# Altium project nixie display ark.PrjPCB
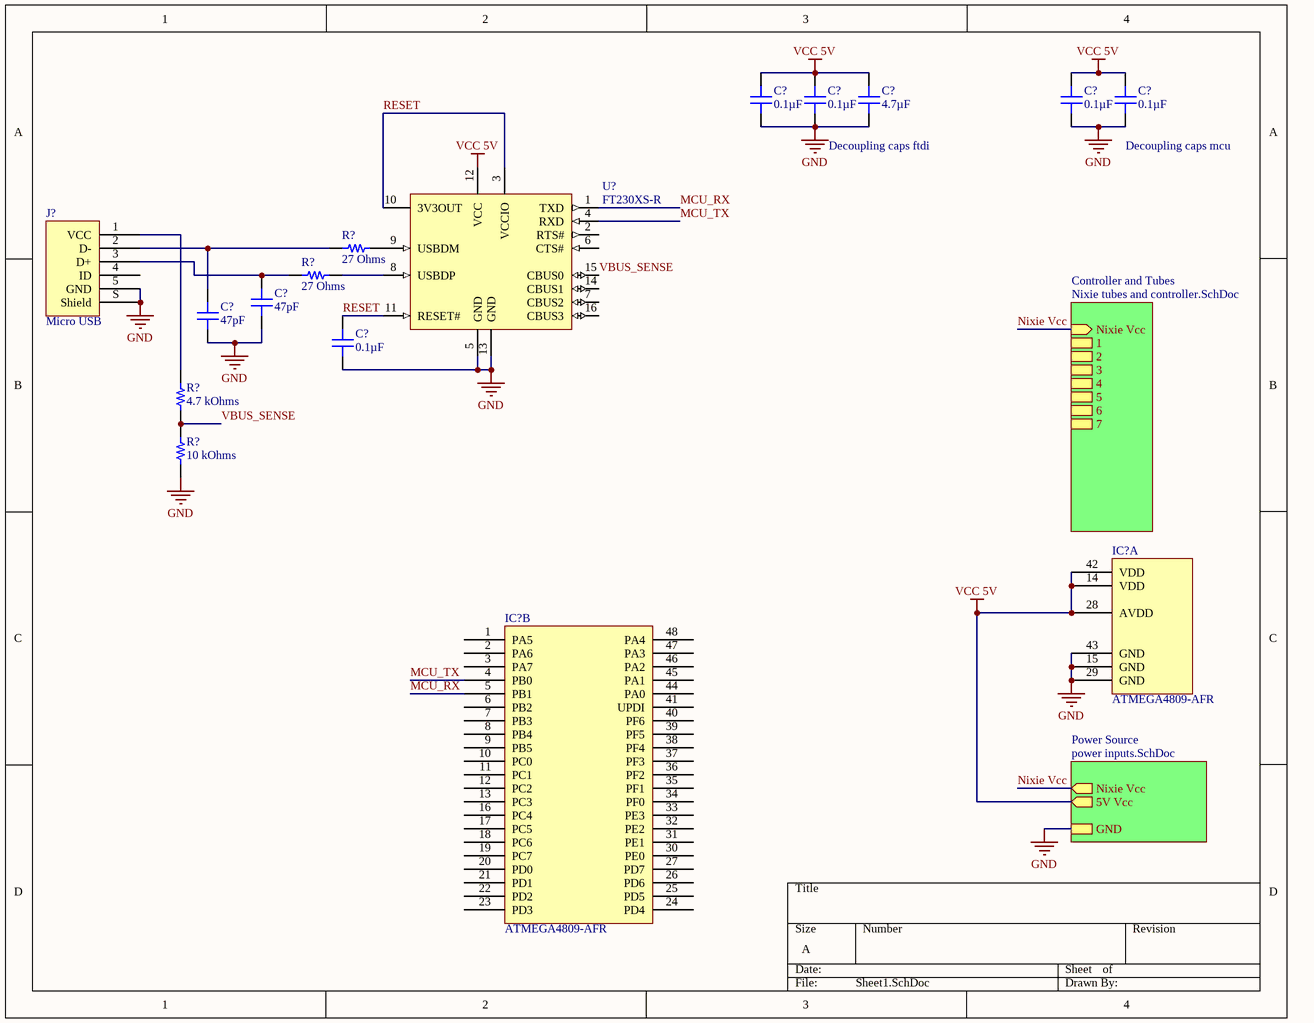
[diagram p0: Sheet1.SchDoc]
3 sheets, 35 parts. Net scope: hierarchical (ports join the sheet entries above them; power ports are global).
Sheets:
  Sheet1.SchDoc
    Controller and Tubes = Nixie tubes and controller.SchDoc
    Power Source = power inputs.SchDoc

## Sheet Sheet1.SchDoc
size A

### Parts
(Parts that share a designator on the sheet are numbered #1, #2 ... from top to bottom, then left to right.)
C?#1  0.1µF  [CAP 0805_2012]
C?#2  0.1µF  [CAP 0805_2012]
C?#3  4.7µF  [CAP 0805_2012]
C?#4  0.1µF  [CAP 0805_2012]
C?#5  0.1µF  [CAP 0805_2012]
C?#6  47pF  [CAP 0805_2012]
C?#7  47pF  [CAP 0805_2012]
C?#8  0.1µF  [CAP 0805_2012]
IC?#1  ATMEGA4809-AFR  [ATMEGA4809-AFR]  (part A of 2)
IC?#2  ATMEGA4809-AFR  [ATMEGA4809-AFR]  (part B of 2)
J?#1  Micro USB  [FCI USB 10118193-0001LF]
R?#1  27 Ohms  [RES 0805_2012]
R?#2  27 Ohms  [RES 0805_2012]
R?#3  4.7 kOhms  [RES 0805_2012]
R?#4  10 kOhms  [RES 0805_2012]
U?#1  FT230XS-R  [SSOP-16_M]

### Sub-sheets
Controller and Tubes = Nixie tubes and controller.SchDoc: Nixie Vcc (in), 1, 2, 3, 4, 5, 6, 7
Power Source = power inputs.SchDoc: 5V Vcc (out), Nixie Vcc (out), GND

### Nets
GND: C?#1.1 C?#2.1 C?#3.1 C?#4.1 C?#5.1 C?#6.1 C?#7.1 C?#8.1 IC?#1.15(GND) IC?#1.29(GND) IC?#1.43(GND) J?#1.5(GND) J?#1.S(Shield) R?#4.1 U?#1.5(GND) U?#1.13(GND) ; sheet Power Source/GND
Nixie Vcc: sheet Controller and Tubes/Nixie Vcc, sheet Power Source/Nixie Vcc
VCC 5V: C?#1.2 C?#2.2 C?#3.2 C?#4.2 C?#5.2 IC?#1.14(VDD) IC?#1.28(AVDD) IC?#1.42(VDD) U?#1.12(VCC) ; sheet Power Source/5V Vcc
MCU_RX: IC?#2.5(PB1) U?#1.1(TXD)
MCU_TX: IC?#2.4(PB0) U?#1.4(RXD)
RESET: C?#8.2 U?#1.3(VCCIO) U?#1.10(3V3OUT) U?#1.11(RESET#)
VBUS_SENSE: R?#3.1 R?#4.2 U?#1.15(CBUS0)
NetC?#6_2: C?#6.2 J?#1.3(D+) R?#2.1
NetC?#7_2: C?#7.2 J?#1.2(D-) R?#1.1
NetJ?#1_1: J?#1.1(VCC) R?#3.2
NetR?#1_2: R?#1.2 U?#1.9(USBDM)
NetR?#2_2: R?#2.2 U?#1.8(USBDP)

Not connected (* = marked no-connect by the designer): IC?#2 1(PA5) 2(PA6) 3(PA7) 6(PB2) 7(PB3) 8(PB4) 9(PB5) 10(PC0) 11(PC1) 12(PC2) 13(PC3) 16(PC4) 17(PC5) 18(PC6) 19(PC7) 20(PD0) 21(PD1) 22(PD2) 23(PD3) 24(PD4) 25(PD5) 26(PD6) 27(PD7) 30(PE0) 31(PE1) 32(PE2) 33(PE3) 34(PF0) 35(PF1) 36(PF2) 37(PF3) 38(PF4) 39(PF5) 40(PF6) 41(UPDI) 44(PA0) 45(PA1) 46(PA2) 47(PA3) 48(PA4); J?#1 4(ID); U?#1 2(RTS#) 6(CTS#) 7(CBUS2) 14(CBUS1) 16(CBUS3)

### Notes on the sheet
- (near C?#3) Decoupling caps ftdi
- (near C?#5) Decoupling caps mcu

### Library data of the parts
C?#1 C?#2 C?#4 C?#5 C?#8 = 0805ZD104KAT2A: CAP CER 0.1UF 10V X5R 0805; Manufacturer: AVX Corporation; Tolerance: ±10%; Part Number: 0805ZD104KAT2A; Value: 0.1µF; Applications: General Purpose; Capacitance: 0.1µF; ComponentLink1Description: Datasheet; ComponentLink1URL: http://datasheets.avx.com/cx5r.pdf; ComponentLink2Description: DigiKey Link; ComponentLink2URL: http://digikey.com/product-detail/en/avx-corporation/0805ZD104KAT2A/478-12799-1-ND/9949339; Device Package: 0805 (2012 Metric); LastUpdated: 21.01.2020 00:02:37; Lifecycle Status: Active; Minimum Order: 1; Mounting Type: Surface Mount, MLCC; Operating Temperature: -55°C ~ 85°C; Package / Case: 0805 (2012 Metric); Packaging: TapeAndReel; PartId: 18470; Part Status: Active; Price: 0.01; Series: -; Size / Dimension: 0.079" L x 0.049" W (2.01mm x 1.25mm); Supplier 1: DigiKey; Supplier Part Number 1: 478-12799-1-ND; Temperature Coefficient: X5R; Thickness (Max): 0.055" (1.40mm); Voltage - Rated: 10V
C?#3 = C2012X6S1E475M125AC: CAP CER 4.7UF 25V X6S 0805; Manufacturer: TDK Corporation; Tolerance: ±20%; Part Number: C2012X6S1E475M125AC; Value: 4.7µF; Applications: General Purpose; Capacitance: 4.7µF; ComponentLink1Description: Datasheet; ComponentLink1URL: https://product.tdk.com/info/en/catalog/datasheets/mlcc_commercial_general_en.pdf?ref_disty=digikey; ComponentLink2Description: DigiKey Link; ComponentLink2URL: http://digikey.com/product-detail/en/tdk-corporation/C2012X6S1E475M125AC/445-7606-1-ND/2733678; Device Package: 0805 (2012 Metric); Features: Low ESL; LastUpdated: 21.01.2020 00:02:51; Lifecycle Status: Active; Minimum Order: 1; Mounting Type: Surface Mount, MLCC; Operating Temperature: -55°C ~ 105°C; Package / Case: 0805 (2012 Metric); Packaging: TapeAndReel; PartId: 12556; Part Status: Active; Price: 0.14; Series: C; Size / Dimension: 0.079" L x 0.049" W (2.00mm x 1.25mm); Supplier 1: DigiKey; Supplier Part Number 1: 445-7606-1-ND; Temperature Coefficient: X6S; Thickness (Max): 0.057" (1.45mm); Voltage - Rated: 25V
C?#6 C?#7 = C0805C470G5GAC7800: CAP CER 47PF 50V NP0 0805; Manufacturer: KEMET; Temperature Coefficient: C0G, NP0; Tolerance: ±2%; Part Number: C0805C470G5GAC7800; Value: 47pF; Applications: General Purpose; Capacitance: 47pF; ComponentLink1Description: Datasheet; ComponentLink1URL: https://api.kemet.com/component-edge/download/datasheet/C0805C470G5GACTU.pdf; ComponentLink2Description: DigiKey Link; ComponentLink2URL: http://digikey.com/product-detail/en/kemet/C0805C470G5GAC7800/399-14601-1-ND/7103893; Device Package: 0805 (2012 Metric); Features: Low ESL; LastUpdated: 21.01.2020 00:03:00; Lifecycle Status: Active; Minimum Order: 1; Mounting Type: Surface Mount, MLCC; Operating Temperature: -55°C ~ 125°C; Package / Case: 0805 (2012 Metric); Packaging: TapeAndReel; PartId: 6181; Part Status: Active; Price: 0.14; Series: SMD Comm C0G; Size / Dimension: 0.079" L x 0.049" W (2.00mm x 1.25mm); Supplier 1: DigiKey; Supplier Part Number 1: 399-14601-1-ND; Thickness (Max): 0.035" (0.88mm); Voltage - Rated: 50V
IC?#1 IC?#2 = ATMEGA4809-AFR: Manufacturer: Microchip; Manufacturer Part No: ATMEGA4809-AFR; Order Code: *; Component Type: IC; Supplier: *
J?#1 = 10118193-0001LF: CONN USB MICRO B RECPT SMT R/A; Part Number: 10118193-0001LF
R?#1 R?#2 = CRGP0805F27R: CRGP 0805 27R 1%; Manufacturer: TE Connectivity Passive Product; Power (Watts): 0.333W, 1/3W; Temperature Coefficient: ±200ppm/°C; Part Number: CRGP0805F27R; Value: 27 Ohms; ComponentLink1Description: Datasheet; ComponentLink1URL: https://www.te.com/commerce/DocumentDelivery/DDEController?Action=srchrtrv&DocNm=9-1773463-9&DocType=DS&DocLang=English; ComponentLink2Description: DigiKey Link; ComponentLink2URL: http://digikey.com/product-detail/en/te-connectivity-passive-product/CRGP0805F27R/A130458CT-ND/8578290; Composition: Thick Film; Device Package: 0805 (2012 Metric); Features: Pulse Withstanding; Height - Seated (Max): 0.026" (0.65mm); LastUpdated: 21.01.2020 01:49:38; Lifecycle Status: Active; Minimum Order: 1; Number of Terminations: 2; Operating Temperature: -55°C ~ 155°C; Package / Case: 0805 (2012 Metric); Packaging: TapeAndReel; PartId: 28706; Part Status: Active; Price: 0.02; Resistance: 27 Ohms; Series: CRGP; Size / Dimension: 0.079" L x 0.049" W (2.00mm x 1.25mm); Supplier 1: DigiKey; Supplier Part Number 1: A130458CT-ND; Supplier Device Package: 0805; Tolerance: ±1%
R?#3 = RCS08054K70JNEA: RES SMD 4.7K OHM 5% 0.4W 0805; Manufacturer: Vishay Dale; Power (Watts): 0.4W, 2/5W; Temperature Coefficient: ±200ppm/°C; Part Number: RCS08054K70JNEA; Value: 4.7 kOhms; ComponentLink1Description: Datasheet; ComponentLink1URL: http://www.vishay.com/docs/20065/rcse3.pdf; ComponentLink2Description: DigiKey Link; ComponentLink2URL: http://digikey.com/product-detail/en/vishay-dale/RCS08054K70JNEA/541-2866-1-ND/5867159; Composition: Thick Film; Device Package: 0805 (2012 Metric); Features: Automotive AEC-Q200, Pulse Withstanding; Height - Seated (Max): 0.020" (0.50mm); LastUpdated: 21.01.2020 01:50:02; Lifecycle Status: Active; Minimum Order: 1; Number of Terminations: 2; Operating Temperature: -55°C ~ 155°C; Package / Case: 0805 (2012 Metric); Packaging: TapeAndReel; PartId: 27839; Part Status: Active; Price: 0.02; Ratings: AEC-Q200; Resistance: 4.7 kOhms; Series: AccliMate™ RCU; Size / Dimension: 0.079" L x 0.049" W (2.00mm x 1.25mm); Supplier 1: DigiKey; Supplier Part Number 1: 541-2866-1-ND; Supplier Device Package: 0805; Tolerance: ±5%
R?#4 = RNCS0805BKE10K0: RES 10K OHM 0.1% 1/10W 0805; Manufacturer: Stackpole Electronics Inc; Power (Watts): 0.1W, 1/10W; Temperature Coefficient: ±25ppm/°C; Part Number: RNCS0805BKE10K0; Value: 10 kOhms; ComponentLink1Description: Datasheet; ComponentLink1URL: https://www.seielect.com/catalog/sei-rncs_rnch.pdf; ComponentLink2Description: DigiKey Link; ComponentLink2URL: http://digikey.com/product-detail/en/stackpole-electronics-inc/RNCS0805BKE10K0/RNCS0805BKE10K0CT-ND/1800164; Composition: Thin Film; Device Package: 0805 (2012 Metric); Features: Anti-Corrosive, Automotive AEC-Q200, Moisture Resistant; Height - Seated (Max): 0.026" (0.65mm); LastUpdated: 21.01.2020 01:50:08; Lifecycle Status: Active; Minimum Order: 1; Number of Terminations: 2; Operating Temperature: -55°C ~ 155°C; Package / Case: 0805 (2012 Metric); Packaging: TapeAndReel; PartId: 27713; Part Status: Active; Price: 0.09; Ratings: AEC-Q200; Resistance: 10 kOhms; Series: RNCS; Size / Dimension: 0.079" L x 0.049" W (2.00mm x 1.25mm); Supplier 1: DigiKey; Supplier Part Number 1: RNCS0805BKE10K0CT-ND; Supplier Device Package: 0805; Tolerance: ±0.1%
U?#1 = CMP-0248-00026-2: USB to Basic UART Interface Chip, UHCI/OHCI/EHCI Compatible, USB 2.0 Compatible, -40 to +85 degC, 16-Pin SSOP, Pb-Free, Tape and Reel; Manufacturer: FTDI; DatasheetVersion: ver 1.2, Feb-2013; PackageDescription: 16-Pin Small Outline Package, 8.6 x 3.9 mm Body, 0.635 mm Pitch; ComponentLink1Description: Manufacturer URL; ComponentLink2Description: Datasheet; ComponentLink2URL: http://www.ftdichip.com/Support/Documents/DataSheets/ICs/DS_FT230X.pdf; ComponentLink3URL: www.ftdichip.com/Products/ICs/FT230X.html; ComponentLink3Description: FT230X Product Page; PackageReference: SSOP-16; ComponentLink1URL: http://www.ftdichip.com/; PartNumber: FT230XS-R; RevisionNote: DatasheetVersion updated to 1.2 Feb-2013; Code_JEDEC: MO-137-AB; PackageVersion: Feb-13

## Sheet Nixie tubes and controller.SchDoc
size A4

## Sheet power inputs.SchDoc
size A4
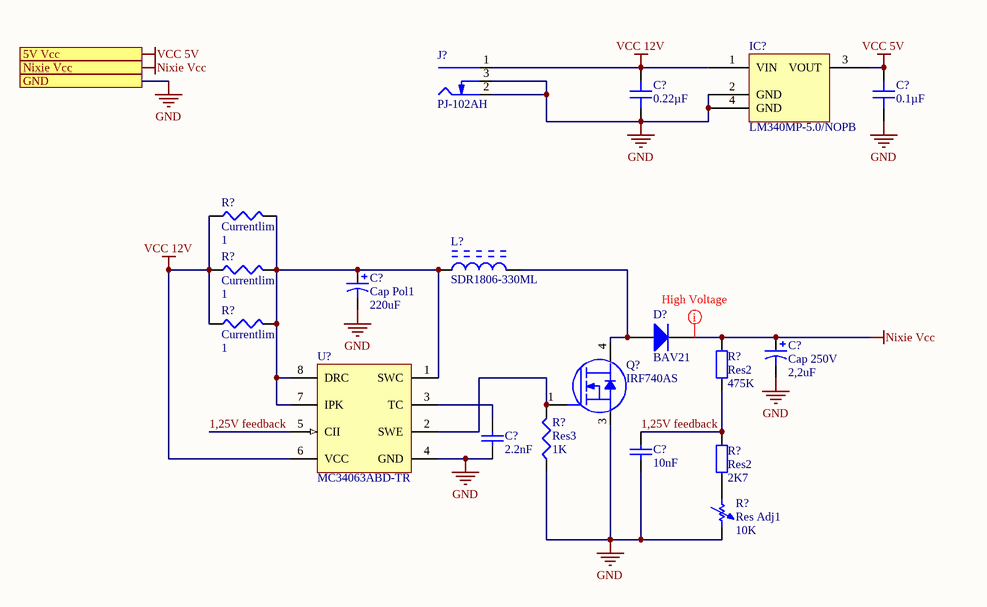
[diagram p1: power inputs.SchDoc]

### Parts
(Parts that share a designator on the sheet are numbered #1, #2 ... from top to bottom, then left to right.)
C?#9  0.22µF  [CAP 0805_2012]
C?#10  0.1µF  [CAP 0805_2012]
C?#11  Cap Pol1  value 220uF  [RB7.6-15]
C?#12  Cap 250V  value 2,2uF  [RB7.6-15]
C?#13  2.2nF  [CAPC0805(2012)145_M]
C?#14  10nF  [CAPC0805(2012)145_M]
D?  BAV21  [DO-41]
IC?#3  LM340MP-5.0/NOPB  [TI SOT-223 DCY]
J?#2  PJ-102AH  [CUI PJ-102AH]
L?  SDR1806-330ML  [BOUR-SDR1806_V]
Q?  IRF740AS  [TO-263AB]
R?#5  Currentlim  value 1  [J1-0603]
R?#6  Currentlim  value 1  [J1-0603]
R?#7  Currentlim  value 1  [J1-0603]
R?#8  Res2  value 475K  [AXIAL-0.4]
R?#9  Res3  value 1K  [J1-0603]
R?#10  Res2  value 2K7  [AXIAL-0.4]
R?#11  Res Adj1  value 10K  [AXIAL-0.7]
U?#2  MC34063ABD-TR  [SO8_N]

### Ports
5V Vcc (out), GND, Nixie Vcc (out)

### Nets
GND: C?#9.1 C?#10.1 C?#11.2 C?#12.2 C?#13.1 C?#14.1 IC?#3.2(GND) IC?#3.4(GND) J?#2.2(Outer) J?#2.3(SW) Q?.3(Drain) R?#9.1 R?#11.2 U?#2.4(GND) ; port GND
Nixie Vcc: C?#12.1 D?.2(K) R?#8.2 ; port Nixie Vcc
VCC 5V: C?#10.2 IC?#3.3(VOUT) ; port 5V Vcc
VCC 12V: C?#9.2 IC?#3.1(VIN) J?#2.1(Centre) R?#5.1 R?#6.1 R?#7.1 U?#2.6(VCC)
1,25V feedback: C?#14.2 R?#8.1 R?#10.2 U?#2.5(CII)
NetC?#11_1: C?#11.1 L?.1 R?#5.2 R?#6.2 R?#7.2 U?#2.1(SWC) U?#2.7(IPK) U?#2.8(DRC)
NetC?#13_2: C?#13.2 U?#2.3(TC)
NetD?_1: D?.1(A) L?.2 Q?.4(Source)
NetQ?_1: Q?.1(Gate) R?#9.2 U?#2.2(SWE)
NetR?#10_1: R?#10.1 R?#11.1

### Layout directives
mark named High Voltage: Nixie Vcc

### Library data of the parts
C?#9 = CC0805KRX7R8BB224: CAP CER 0.22UF 25V X7R 0805; Manufacturer: Yageo; Tolerance: ±10%; Part Number: CC0805KRX7R8BB224; Value: 0.22µF; Applications: General Purpose; Capacitance: 0.22µF; ComponentLink1Description: Datasheet; ComponentLink1URL: https://www.yageo.com/upload/media/product/productsearch/datasheet/mlcc/UPY-GPHC_X7R_6.3V-to-50V_18.pdf; ComponentLink2Description: DigiKey Link; ComponentLink2URL: http://digikey.com/product-detail/en/yageo/CC0805KRX7R8BB224/311-1432-1-ND/2833738; Device Package: 0805 (2012 Metric); Features: High Voltage; LastUpdated: 21.01.2020 00:03:06; Lifecycle Status: Active; Minimum Order: 1; Mounting Type: Surface Mount, MLCC; Operating Temperature: -55°C ~ 125°C; Package / Case: 0805 (2012 Metric); Packaging: TapeAndReel; PartId: 2517; Part Status: Active; Price: 0.02; Series: CC; Size / Dimension: 0.079" L x 0.049" W (2.00mm x 1.25mm); Supplier 1: DigiKey; Supplier Part Number 1: 311-1432-1-ND; Temperature Coefficient: X7R; Thickness (Max): 0.037" (0.95mm); Voltage - Rated: 25V
C?#10 = 0805ZD104KAT2A: as C?#1 on sheet Sheet1; Part Number: 0805ZD104KAT2A; Value: 0.1µF; Applications: General Purpose; Capacitance: 0.1µF; ComponentLink1Description: Datasheet; ComponentLink1URL: http://datasheets.avx.com/cx5r.pdf; ComponentLink2Description: DigiKey Link; ComponentLink2URL: http://digikey.com/product-detail/en/avx-corporation/0805ZD104KAT2A/478-12799-1-ND/9949339; Device Package: 0805 (2012 Metric); LastUpdated: 21.01.2020 00:02:37; Lifecycle Status: Active; Minimum Order: 1; Mounting Type: Surface Mount, MLCC; Operating Temperature: -55°C ~ 85°C; Package / Case: 0805 (2012 Metric); Packaging: TapeAndReel; PartId: 18470; Part Status: Active; Price: 0.01; Series: -; Size / Dimension: 0.079" L x 0.049" W (2.01mm x 1.25mm); Supplier 1: DigiKey; Supplier Part Number 1: 478-12799-1-ND; Temperature Coefficient: X5R; Thickness (Max): 0.055" (1.40mm); Voltage - Rated: 10V
C?#11 C?#12 = Cap Pol1: Polarized Capacitor (Radial); Published: 8-Jun-2000; LatestRevisionDate: 17-Jul-2002; LatestRevisionNote: Re-released for DXP Platform.; PackageReference: RB7.6-15; Publisher: Altium Limited; PackageDescription: Polarized Capacitor (Radial); 2 Leads
C?#13 C?#14 = CMP-1036-03245-1: CAP 2.2nF 16V ±10% 0805 (2012 Metric) Thickness 1.45mm SMD; Case-EIA: 0805; Tolerance: Â±10%; Case-Metric: 2012; Rated Voltage: 16 V; Technology: SMT; Value: 2.2nF; Max Thickness: 1.45 mm
D? = Diode 1N4006: Published: 8-Jun-2000; LatestRevisionDate: 17-Jul-2002; LatestRevisionNote: Re-released for DXP Platform.; DatasheetVersion: 1998; PackageVersion: Aug-1999; PackageReference: DO-41; Publisher: Altium Limited; PackageDescription: Diode, Axial; Body 5.2 x 2.7 mm (LxDia. max), Lead Dia. 0.86 mm (max); Code_JEDEC: DO-204-AL; ComponentLink1Description: Manufacturer Link; ComponentLink1URL: http://www.fairchildsemi.com/; ComponentLink2Description: Datasheet; ComponentLink2URL: http://www.fairchildsemi.com/ds/1N%2F1N4001.pdf
IC?#3 = LM340MP-5.0/NOPB: IC REG LINEAR 5V 1A SOT223-4; Manufacturer: Texas Instruments; Current - Output: 1.5A; Current - Quiescent (Iq): 8mA; Number of Regulators: 1; Output Configuration: Positive; Output Type: Fixed; Protection Features: Over Current, Short Circuit; PSRR: 70dB (120Hz); Voltage Dropout (Max): 2V @ 1A; Voltage - Input (Max): 35V; Part Number: LM340MP-5.0/NOPB; ComponentLink1Description: Datasheet; ComponentLink1URL: http://www.ti.com/general/docs/suppproductinfo.tsp?distId=10&gotoUrl=http%3A%2F%2Fwww.ti.com%2Flit%2Fgpn%2Flm340; ComponentLink2Description: DigiKey Link; ComponentLink2URL: //digikey.com/product-detail/en/texas-instruments/LM340MP-5.0-NOPB/LM340MP-5.0-NOPBTR-ND/270717; Device Package: TO-261-4, TO-261AA; LastUpdated: 09.12.2019 14:40:17; Lifecycle Status: 0; Minimum Order: 1; Mounting Type: Surface Mount; Operating Temperature: 0°C ~ 125°C; Package / Case: TO-261-4, TO-261AA; Packaging: TapeAndReel; Part Status: Active; Price: 0.56; Series: -; Supplier 1: DigiKey; Supplier Part Number 1: LM340MP-5.0/NOPBTR-ND; Supplier Device Package: SOT-223-4; Voltage - Output (Min/Fixed): 5V
J?#2 = PJ-102AH: CONN PWR JACK 2X5.5MM SOLDER; Manufacturer: CUI Devices; Actual Diameter: 0.079" (2.00mm ID), 0.256" (6.50mm OD); Current Rating (Amps): 5A; Gender: Male; Industry Recognized Mating Diameter: 2.00mm ID (0.079"), 5.50mm OD (0.217"); Internal Switch(s): Single Switch, Normally Closed; Material Flammability Rating: UL94 V-0; Mating Length/Depth: 0.354" (9.00mm); Number of Positions/Contacts: 2 Conductors, 3 Contacts; Shielding: Unshielded; Voltage - Rated: 24VDC; Part Number: PJ-102AH; ComponentLink1Description: Datasheet; ComponentLink1URL: https://www.cuidevices.com/product/resource/digikeypdf/pj-102ah.pdf; ComponentLink2Description: DigiKey Link; ComponentLink2URL: //digikey.com/product-detail/en/cui-devices/PJ-102AH/CP-102AH-ND/408448; Connector Type: Jack; LastUpdated: 16.12.2019 19:01:27; Lifecycle Status: 0; Minimum Order: 1; Mounting Type: Through Hole, Right Angle; Packaging: Tray; Part Status: Active; Price: 0.76; Series: -; Supplier 1: DigiKey; Supplier Part Number 1: CP-102AH-ND; Termination: Solder
L? = CMP-2000-07043-1: Power Inductor, 33 uH, +/- 20%, -40 to 125 degC, 2-Pin SMD, RoHS, Tape and Reel; Manufacturer: Bourns; Minimum Quality Factor: 24@2.52MHz; Product Height: 6.9mm; Core Material: Ferrite; Maximum DC Current: 3A; Maximum DC Resistance: 68mOhm; Product Depth: 14.3mm; Inductance: 33uH; Rad Hard: No; Packaging: Tape&Reel; Mounting Technology: SurfaceMount; Manufacturer URL: http://www.bourns.com/; Package Description: 2-Pin Surface Mount Device, Body 18.3 x 14 mm; Type: Power; Package Reference: SDR1806; Datasheet URL: http://www.bourns.com/docs/Product-Datasheets/SDR1806.pdf; Tolerance: 20%; Datasheet Version: 09/2010; Package/Case: 18.6X14.3X6.9
Q? = 4548: NMos tranistor; id: 4548; pakke_opprettet_av: 2099; pris: 0; produsent: Vishay; pakketype: TO-263; pakke_opprettet: 11.10.2018 00:43:09; symbol_opprettet_av: 2099; symbol_opprettet: 11.10.2018 00:41:25; navn: IRF740AS
R?#5-R?#7 R?#9 = Res3: Resistor; Published: 8-Jun-2000; LatestRevisionDate: 29-May-2009; LatestRevisionNote: IPC-7351 Footprint Added.; PackageReference: J1-0603; Publisher: Altium Limited; PackageDescription: Chip Resistor
R?#8 R?#10 = Res2: Resistor; Published: 8-Jun-2000; LatestRevisionDate: 17-Jul-2002; LatestRevisionNote: Re-released for DXP Platform.; PackageReference: AXIAL-0.4; Publisher: Altium Limited; PackageDescription: Axial Device, Thru-Hole; 2 Leads; 0.4 in Pin Spacing
R?#11 = Res Adj1: Variable Resistor; Set Position: 0.5; Published: 8-Jun-2000; LatestRevisionDate: 17-Jul-2002; LatestRevisionNote: Re-released for DXP Platform.; PackageReference: AXIAL-0.7; Publisher: Altium Limited; PackageDescription: Axial Device, Thru-Hole; 2 Leads; 0.7 in Pin Spacing
U?#2 = CMP-0241-00017-1: DC/DC converter control circuit, 8-Pin SO, Tape and Reel; PackageReference: SO8; DatasheetVersion: Nov-2007; PackageDescription: 8-Pin Small Outline Integrated Circuit 1.27 mm Pitch; ComponentLink3URL: http://www.st.com/internet/com/TECHNICAL_RESOURCES/TECHNICAL_LITERATURE/PACKAGE_INFORMATION/CD00004680.pdf; ComponentLink2Description: Datasheet; PackageVersion: Dec-2002; ComponentLink1URL: http://www.st.com; ComponentLink2URL: http://www.st.com/internet/com/TECHNICAL_RESOURCES/TECHNICAL_LITERATURE/DATASHEET/CD00001232.pdf; ComponentLink1Description: Manufacturer URL; ComponentLink3Description: Package Specification; Code_IPC: SOIC127P600-8; Code_JEDEC: MS-012-AA

## Nets that join several sheets
GND: Sheet1 (16 pins), power inputs (14 pins)
VCC 5V: Sheet1 (9 pins), power inputs (C?#10.2 IC?#3.3)